# EAGLE design pi-frontpanel (EAGLE 6.6.0)
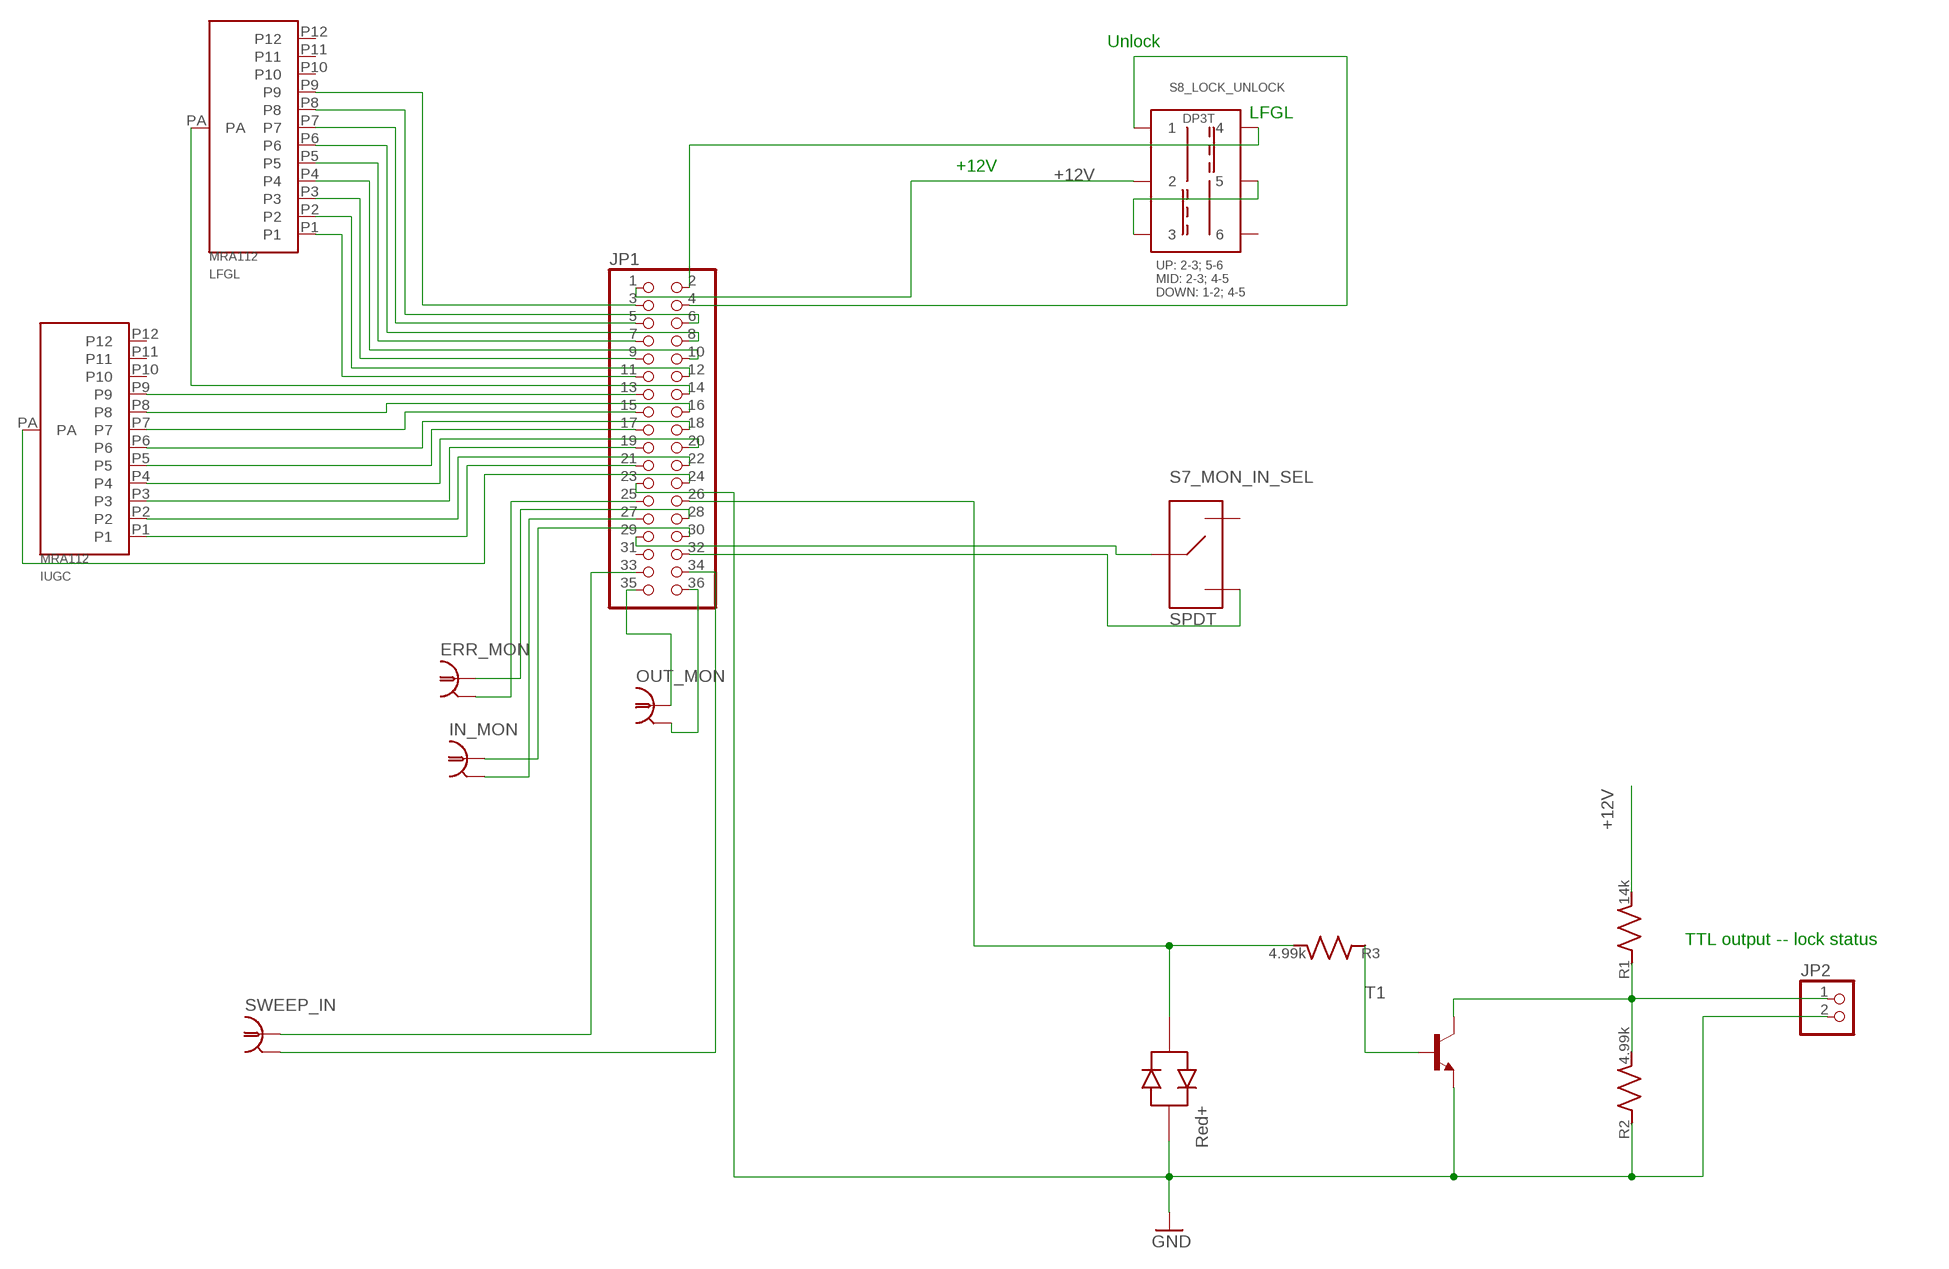
[diagram p0: schematic, sheet 1]

## Parts
ERR_MON  BNC-V  [BNC-V]
IN_MON  BNC-V  [BNC-V]
IUGC  MRA112  [MRA112]
JP1  PINHD-2X18  [2X18]
JP2  PINHD-1X2  [1X02]
LED  SSL-LX5093IGW  [LED-TH]
LFGL  MRA112  [MRA112]
OUT_MON  BNC-V  [BNC-V]
R1  14k  R_SMDR1206  [R_1206]
R2  4.99k  R_SMDR1206  [R_1206]
R3  4.99k  R_SMDR1206  [R_1206]
S7_MON_IN_SEL  SPDT  [SPDT_LUG]
S8_LOCK_UNLOCK  DP3T  [SP3T_LUG]
SWEEP_IN  BNC-V  [BNC-V]
T1  MMBT2222ALT1-NPN-SOT23-BEC  [SOT23-BEC]

## Nets
+12V: JP1.1 R1.P$2 S8_LOCK_UNLOCK.2
GND: JP1.23 JP2.2 LED.P$2(RED+) R2.P$1 T1.E
N$1: S8_LOCK_UNLOCK.3 S8_LOCK_UNLOCK.5
N$2: JP1.3 LFGL.P9
N$3: JP2.1 R1.P$1 R2.P$2 T1.C
N$5: R3.P$1 T1.B
N$6: JP1.26 LED.P$1(GREEN+) R3.P$2
N$7: JP1.6 LFGL.P8
N$8: JP1.5 LFGL.P7
N$9: JP1.8 LFGL.P6
N$10: JP1.7 LFGL.P5
N$11: JP1.10 LFGL.P4
N$12: JP1.11 LFGL.P1
N$13: JP1.9 LFGL.P3
N$14: JP1.12 LFGL.P2
N$15: IUGC.P9 JP1.13
N$16: JP1.14 LFGL.PA
N$17: IUGC.P8 JP1.16
N$18: IUGC.P7 JP1.15
N$19: IUGC.P6 JP1.18
N$20: IUGC.P5 JP1.17
N$21: IUGC.P4 JP1.20
N$22: IUGC.P3 JP1.19
N$23: IUGC.P2 JP1.22
N$24: IUGC.P1 JP1.21
N$25: IUGC.PA JP1.24
N$26: IN_MON.2 JP1.27
N$27: IN_MON.1 JP1.30
N$28: ERR_MON.2 JP1.25
N$29: ERR_MON.1 JP1.28
N$30: JP1.36 OUT_MON.2
N$31: JP1.35 OUT_MON.1
N$32: JP1.34 SWEEP_IN.2
N$33: JP1.33 SWEEP_IN.1
N$34: JP1.29 S7_MON_IN_SEL.2
N$35: JP1.32 S7_MON_IN_SEL.3
N$37: JP1.2 S8_LOCK_UNLOCK.4
N$38: JP1.4 S8_LOCK_UNLOCK.1
Unconnected: IUGC.P10 IUGC.P11 IUGC.P12 JP1.31 LFGL.P10 LFGL.P11 LFGL.P12 S7_MON_IN_SEL.1 S8_LOCK_UNLOCK.6

## Notes on the sheet
- Unlock
- LFGL
- +12V
- TTL output -- lock status

## Library data of the parts
ERR_MON IN_MON OUT_MON SWEEP_IN = connector-jqi:BNC: BNC Connector.; PARTNO: A32262-ND
IUGC LFGL = pi-frontpanel:MRA112; PARTNO: 360-2368-ND
JP1 = pinhead:PINHD-2X18: PIN HEADER; PARTNO: S7086-ND
JP2 = pinhead:PINHD-1X2: PIN HEADER; PARTNO: A1921-ND
LED = pi-frontpanel:SSL-LX5093IGW; PARTNO: 67-2207-ND
R1 = jqi_passives:R_SMD; PARTNO: P14.0KFCT-ND
R2 R3 = jqi_passives:R_SMD; PARTNO: P4.99KFCT-ND
S7_MON_IN_SEL = pi-frontpanel:SPDT; PARTNO: 450-1523-ND
S8_LOCK_UNLOCK = pi-frontpanel:DP3T: Use, eg, digikey 450-1536-ND; PARTNUM: 450-1536-ND
T1 = transistor:*-NPN-: NPN Transistror BF959 corrected 2008.03.06; PARTNO: MMBT2222A-FDICT-ND

## Board
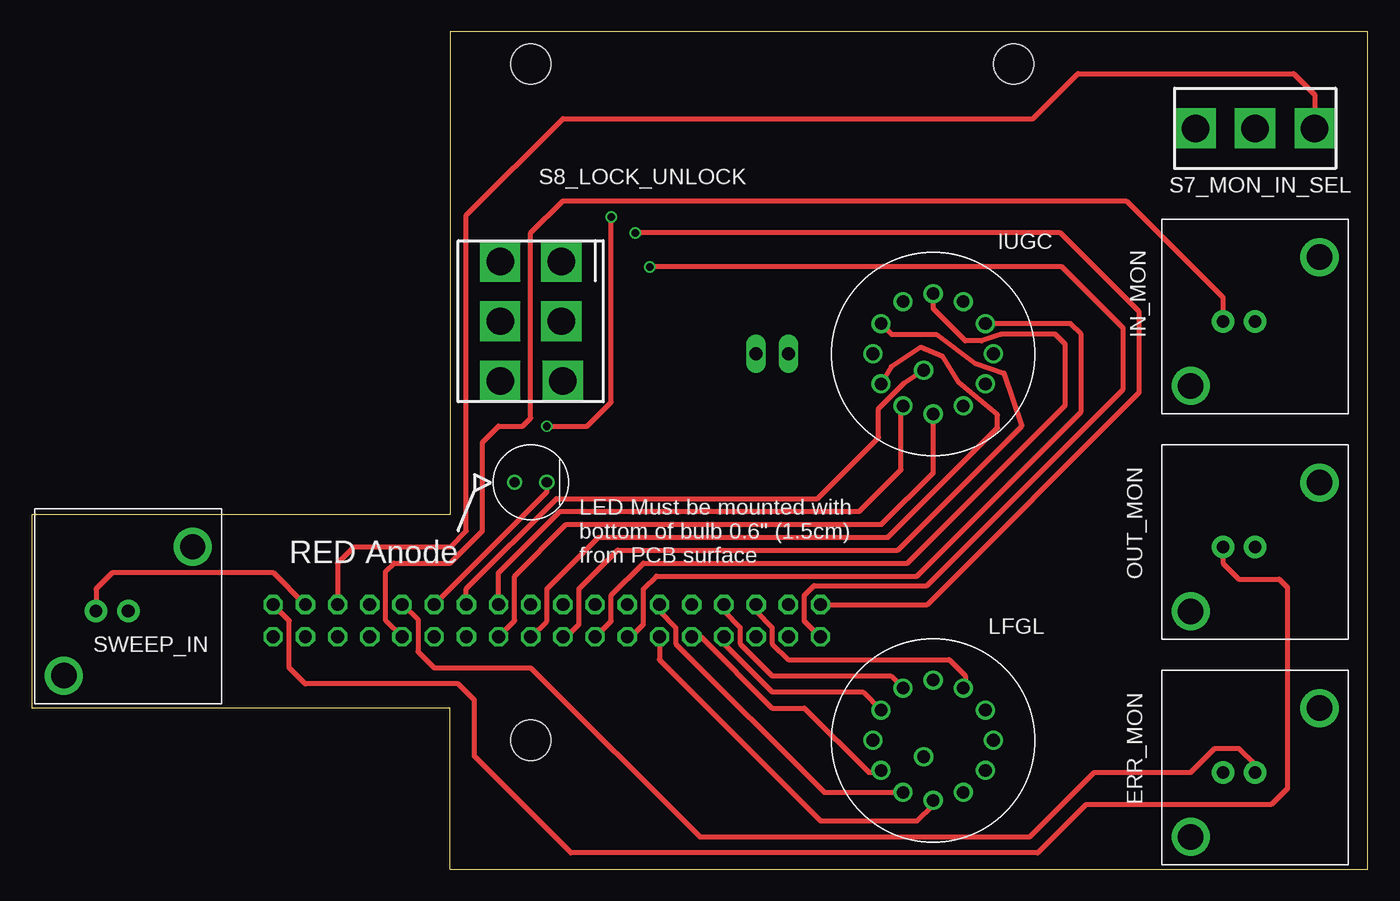
[diagram p1: board, top side]
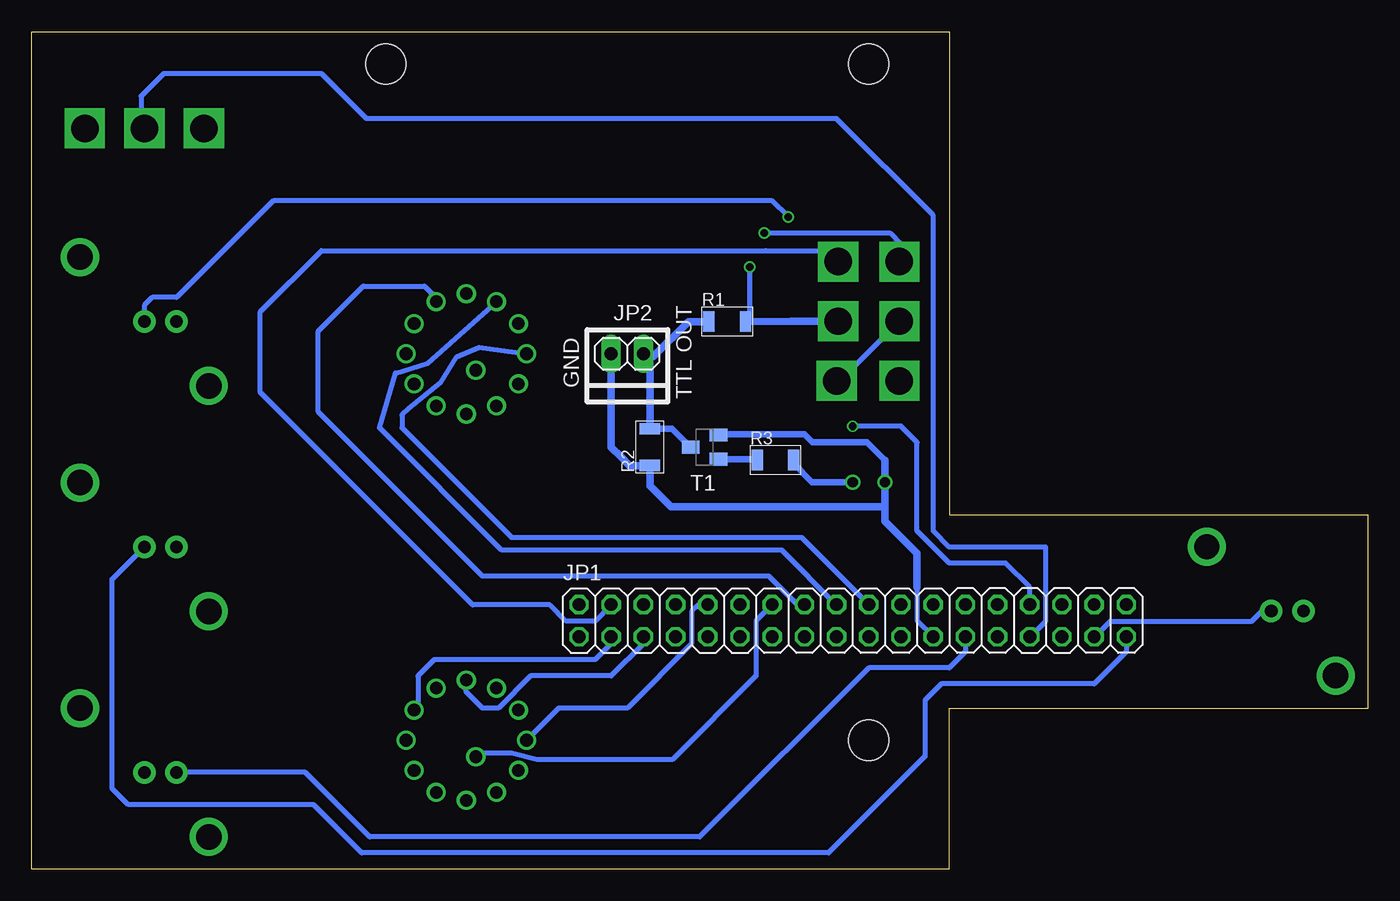
[diagram p2: board, bottom side, seen from below]

Size 105.41 x 66.04 mm. Coordinates in mm from the lower left corner, seen from the top.
Outline: 105.41,0 105.41,66.04 33.02,66.04 33.02,27.94 0,27.94 0,12.7 33.02,12.7 33.02,0 105.41,0
Copper layers (1*16): Top 0.035mm / dielectric 1.5mm / Bottom 0.035mm
Design rules "MF_Standard_2_Layer": minimum track width 5mil, minimum drill 10mil, track to track 5mil, track to pad 5mil, pad to pad 5mil, via to via 5mil, smd to smd 0mil, copper to edge 10mil, drill to drill 10mil, minimum pad ring 4mil, minimum via ring 4mil, stop-mask expansion 2mil, vias tented up to drill 25mil, thermal gap 10mil
Holes 3.17 mm at 39.37,10.16 39.37,63.5 77.47,63.5

### Footprints (pad centres in the part's own frame; a part is rotated, then mirrored left to right if it is on the bottom)
BNC-V = drill 1 pad 1.778: 1 0,0; 2 -2.54,0 | drill 2 pad 2.032: ANCHOR1 -5.08,-5.08; ANCHOR2 5.08,5.08
MRA112 = drill 1: P1 0,-4.75; P2 -2.375,-4.114; P3 -4.114,-2.375; P4 -4.75,0; P5 -4.114,2.375; P6 -2.375,4.114; P7 0,4.75; P8 2.375,4.114; P9 4.114,2.375; P10 4.75,0; P11 4.114,-2.375; P12 2.375,-4.114; PA -0.75,-1.299
2X18 = drill 1.016 octagon: 1 -21.59,-1.27; 2 -21.59,1.27; 3 -19.05,-1.27; 4 -19.05,1.27; 5 -16.51,-1.27; 6 -16.51,1.27; 7 -13.97,-1.27; 8 -13.97,1.27; 9 -11.43,-1.27; 10 -11.43,1.27; 11 -8.89,-1.27; 12 -8.89,1.27; 13 -6.35,-1.27; 14 -6.35,1.27; 15 -3.81,-1.27; 16 -3.81,1.27; 17 -1.27,-1.27; 18 -1.27,1.27; 19 1.27,-1.27; 20 1.27,1.27; 21 3.81,-1.27; 22 3.81,1.27; 23 6.35,-1.27; 24 6.35,1.27; 25 8.89,-1.27; 26 8.89,1.27; 27 11.43,-1.27; 28 11.43,1.27; 29 13.97,-1.27; 30 13.97,1.27; 31 16.51,-1.27; 32 16.51,1.27; 33 19.05,-1.27; 34 19.05,1.27; 35 21.59,-1.27; 36 21.59,1.27
1X02 = drill 1.016 long: 1 -1.27,0; 2 1.27,0
LED-TH = drill 0.8: P$1 1.27,0; P$2 -1.27,0
R_1206 = smd 0.9 x 1.6: P$1 -1.45,0; P$2 1.45,0
SPDT_LUG = drill 2.159 square: 1 0,4.699; 2 0,0; 3 0,-4.699
SP3T_LUG = drill 2.159 square: 1 2.413,4.699; 2 2.413,0; 3 2.54,-4.699; 4 -2.413,4.699; 5 -2.413,0; 6 -2.413,-4.699
SOT23-BEC = smd 1 x 1.4: B -0.95,-1.1; C 0,1.1; E 0.95,-1.1

### Placement (x,y rotation side)
ERR_MON  96.52,7.62 0 top
IN_MON  96.52,43.18 0 top
IUGC  71.12,40.64 0 top
JP1  40.64,19.6 0 bottom
JP2  58.42,40.64 180 bottom
LED  39.37,30.51 0 top
LFGL  71.12,10.16 0 top
OUT_MON  96.52,25.4 0 top
R1  50.55,43.18 0 bottom
R2  56.64,33.27 90 bottom
R3  46.74,32.26 0 bottom
S7_MON_IN_SEL  96.52,58.42 90 top
S8_LOCK_UNLOCK  39.37,43.21 0 top
SWEEP_IN  7.62,20.35 0 top
T1  52.32,33.27 90 bottom

### Tracks (layer width: path | path; a pad name or v marks a point on that pad's centre or on a via)
+12V  (via drill 0.6)
  Top 0.406: JP1.1 62.19,18.33 60.96,19.56 60.96,21.59 61.72,22.35 70.61,22.35 86.11,37.85 86.11,42.67 81.28,47.5 v48.77,47.5
  Bottom 0.406: v48.77,47.5 48.77,43.51 R1.P$2
  Bottom 0.61: R1.P$2 45.52,43.2 S8_LOCK_UNLOCK.2
GND
  Bottom 0.406: JP1.23 35.56,19.6 35.56,22.23
  Bottom 0.508: 38.1,32.26 39.5,33.66 43.81,33.66 44.45,34.29 51.16,34.29 T1.E
  Bottom 0.61: 38.1,32.26 LED.P$2 38.1,28.58 | 38.1,28.58 38.1,27.43 35.56,24.89 35.56,22.23 | 38.1,28.58 54.99,28.58 56.64,30.23 R2.P$1 58.24,31.82 58.93,32.51 59.69,33.27 JP2.2
N$1
  Bottom 0.406: S8_LOCK_UNLOCK.3 41.66,38.51 S8_LOCK_UNLOCK.5
N$2
  Bottom 0.406: JP1.3 59.69,17.78 60.96,16.51 73.66,16.51 74.93,15.24 74.93,12.84 LFGL.P9
N$3
  Bottom 0.508: R2.P$2 54.87,34.72 T1.C
  Bottom 0.61: R1.P$1 53.59,43.18 56.39,40.39 JP2.1 56.64,39.88 R2.P$2
N$5
  Bottom 0.508: R3.P$1 48.63,32.32 T1.B
N$6
  Top 0.406: JP1.26 40.64,29.76 LED.P$1
  Bottom 0.508: LED.P$1 43.84,30.51 45.29,31.95 R3.P$2
N$7
  Top 0.406: JP1.6 57.15,20.32 58.42,19.05 58.42,17.78 59.69,16.51 72.39,16.51 73.66,15.24 73.66,14.44 LFGL.P8
N$8
  Bottom 0.406: JP1.5 57.15,17.78 59.69,15.24 66.04,15.24 68.58,12.7 69.85,12.7 71.12,13.97 LFGL.P7
N$9
  Top 0.406: JP1.8 54.61,20.32 55.88,19.05 55.88,17.78 58.42,15.24 67.78,15.24 LFGL.P6
N$10
  Top 0.406: JP1.7 54.61,17.78 58.42,13.97 65.57,13.97 LFGL.P5
N$11
  Bottom 0.406: JP1.10 52.79,20.87 53.34,20.32 53.34,17.78 58.42,12.7 63.83,12.7 LFGL.P4
N$12
  Top 0.406: JP1.11 49.53,16.51 62.23,3.81 69.85,3.81 71.12,5.08 LFGL.P1
N$13
  Top 0.406: JP1.9 52.79,18.33 58.42,12.7 60.96,12.7 66.04,7.62 66.84,7.62 LFGL.P3
N$14
  Top 0.406: JP1.12 49.53,20.32 50.8,19.05 50.8,17.78 62.53,6.05 LFGL.P2
N$15
  Top 0.406: JP1.13 47.28,18.33 48.26,19.3 48.26,22.1 49.28,23.11 69.85,23.11 82.8,36.07 82.8,42.16 81.95,43.02 IUGC.P9
N$16
  Bottom 0.406: JP1.14 48.26,19.6 48.26,15.24 54.86,8.64 65.53,8.64 67.56,9.14 70.09,9.14 LFGL.PA
N$17
  Bottom 0.406: JP1.16 45,20.87 47.24,23.11 69.85,23.11 82.8,36.07 82.8,42.42 79.25,45.97 74.42,45.97 73.5,45.05 IUGC.P8
N$18
  Top 0.406: JP1.15 44.49,18.33 45.72,19.56 45.72,21.59 48.26,24.13 69.09,24.13 81.53,36.58 81.53,41.4 80.77,42.16 76.45,42.16 74.93,41.66 73.66,41.66 71.12,44.2 IUGC.P7
N$19
  Bottom 0.406: JP1.18 41.95,20.87 46.23,25.15 68.33,25.15 77.98,34.8 76.71,39.12 74.17,39.88 IUGC.P6
N$20
  Top 0.406: JP1.17 42.2,18.33 43.18,19.3 43.18,22.1 46.23,25.15 68.33,25.15 78.11,34.93 76.71,39.12 74.42,39.88 71.37,42.16 67.86,42.16 IUGC.P5
N$21
  Bottom 0.406: JP1.20 44.67,26.16 67.56,26.16 76.2,34.8 76.2,35.81 75.69,36.32 73.15,38.35 71.88,40.39 70.1,41.15 IUGC.P4
N$22
  Top 0.406: JP1.19 39.41,18.33 40.64,19.56 40.64,22.1 44.7,26.16 67.56,26.16 76.2,34.8 76.2,35.81 73.15,38.35 71.88,40.39 70.1,41.15 67.82,39.62 IUGC.P3
N$23
  Top 0.406: JP1.22 36.83,23.37 41.66,28.19 65.28,28.19 68.58,31.5 68.58,36.36 IUGC.P2
N$24
  Top 0.406: JP1.21 38.1,19.6 38.1,23.11 42.16,27.18 67.06,27.18 71.12,31.24 IUGC.P1
N$25
  Top 0.406: JP1.24 34.29,22.1 41.4,29.21 61.98,29.21 66.8,34.04 66.8,36.32 68.83,38.35 IUGC.PA
N$26
  Top 0.406: JP1.27 27.94,19.6 27.94,23.49 28.58,24.13 33.02,24.13 35.56,26.67 35.56,33.66 36.83,34.93 38.73,34.93 39.37,35.56 39.37,50.16 41.91,52.7 86.36,52.7 93.98,45.09 IN_MON.2
N$27  (via drill 0.6)
  Top 0.406: v40.64,34.93 43.81,34.93 45.72,36.83 v45.72,51.44
  Bottom 0.406: JP1.30 26.67,22.23 28.58,24.13 33.02,24.13 35.56,26.67 35.56,33.66 36.83,34.93 v40.64,34.93 | v45.72,51.44 46.99,52.7 86.36,52.7 93.98,45.09 95.88,45.09 96.52,44.45 IN_MON.1
N$28
  Bottom 0.406: JP1.25 31.75,17.15 33.02,15.87 39.37,15.87 52.71,2.54 78.74,2.54 83.82,7.62 ERR_MON.2
N$29
  Top 0.406: JP1.28 29.3,20.87 30.48,19.69 30.48,17.15 31.75,15.87 39.37,15.87 52.71,2.54 78.74,2.54 83.82,7.62 91.44,7.62 93.34,9.53 95.25,9.53 96.52,8.26 ERR_MON.1
N$30
  Top 0.406: OUT_MON.2 93.98,24.13 95.25,22.86 98.43,22.86 99.06,22.23 99.06,6.35 97.79,5.08 83.19,5.08 79.38,1.27 42.55,1.27 34.93,8.89 34.93,13.33 33.66,14.6 21.59,14.6 20.32,15.87 20.32,19.6 JP1.36
N$31
  Bottom 0.406: JP1.35 19.05,17.15 21.59,14.6 33.66,14.6 34.93,13.33 34.93,8.89 42.55,1.27 79.38,1.27 83.19,5.08 97.79,5.08 99.06,6.35 99.06,22.86 OUT_MON.1
N$32
  Top 0.406: JP1.34 19.09,23.37 6.35,23.37 5.08,22.1 SWEEP_IN.2
N$33
  Bottom 0.406: JP1.33 21.55,18.33 20.32,19.56 9.14,19.56 8.36,20.34 SWEEP_IN.1
N$34
  Bottom 0.406: JP1.29 26.63,18.33 25.4,19.56 25.4,25.4 33.02,25.4 34.29,26.67 34.29,51.56 41.91,59.18 78.99,59.18 82.55,62.74 95,62.74 96.77,60.96 96.77,57.91 96.52,58.17 S7_MON_IN_SEL.2
N$35
  Top 0.406: S7_MON_IN_SEL.3 101.22,61.09 99.57,62.74 82.55,62.74 78.99,59.18 41.91,59.18 34.29,51.56 34.29,26.67 33.02,25.4 25.4,25.4 24.13,24.13 JP1.32
N$37  (via drill 0.6)
  Top 0.406: JP1.2 70.65,20.87 87.38,37.59 87.38,43.94 81.15,50.16 v47.62,50.16
  Bottom 0.406: v47.62,50.16 37.72,50.16 36.83,49.28 36.83,48.03 S8_LOCK_UNLOCK.4
N$38
  Bottom 0.406: JP1.4 59.69,20.83 60.96,19.56 63.25,19.56 64.52,20.83 70.61,20.83 87.38,37.59 87.38,43.94 82.55,48.77 47.5,48.77 42.65,48.77 S8_LOCK_UNLOCK.1

### Text on the board
tPlace: RED Anode | LED Must be mounted with / bottom of bulb 0.6" (1.5cm) / from PCB surface
bPlace: TTL OUT | GND
Reference: keepout